# Altium schematic sheet Ampli_audio.SchDoc
size A4
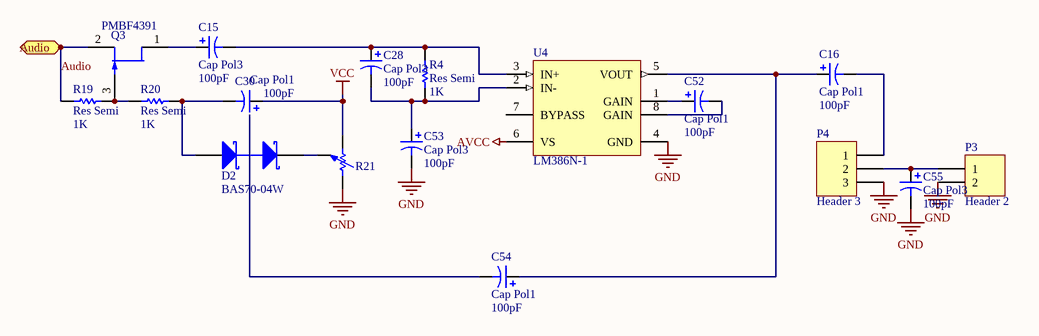
[diagram p0: Ampli_audio.SchDoc]

## Parts
C15  Cap Pol3  value 100pF  [C0805]
C16  Cap Pol1  value 100pF  [B]
C28  Cap Pol3  value 100pF  [C0805]
C30  Cap Pol1  value 100pF  [B]
C52  Cap Pol1  value 100pF  [B]
C53  Cap Pol3  value 100pF  [C0805]
C54  Cap Pol1  value 100pF  [B]
C55  Cap Pol3  value 100pF  [C0805]
D2  BAS70-04W  [SOT323_N]
P3  Header 2  [HDR1X2]
P4  Header 3  [HDR1X3]
Q3  PMBF4391  [SOT23_N]
R4  Res Semi  value 1K  [2012[0805]]
R19  Res Semi  value 1K  [2012[0805]]
R20  Res Semi  value 1K  [2012[0805]]
R21  Pot  [Potenciometro]  (value not drawn)
U4  LM386N-1  [N08E]

## Ports
Audio (in)

## Nets
AVCC: U4.6(VS)
GND: C53.2 C55.2 P3.2 P4.3 R21.1 U4.4(GND)
VCC: C30.1 R21.2
Audio: Q3.2(S) R19.1 ; port Audio
NetC15_1: C15.1 Q3.1(D)
NetC15_2: C15.2 C28.1 R4.2 U4.3(IN+)
NetC16_1: C16.1 C54.1 U4.5(VOUT)
NetC16_2: C16.2 P4.1
NetC28_2: C28.2 C53.1 R4.1 U4.2(IN-)
NetC30_2: C30.2 D2.1(A) R20.2
NetC52_1: C52.1 U4.1(GAIN)
NetC52_2: C52.2 U4.8(GAIN)
NetC54_2: C54.2 D2.3(C)
NetC55_1: C55.1 P3.1 P4.2
NetD2_2: D2.2(K) R21.3
NetQ3_3: Q3.3(G) R19.2 R20.1

Not connected (* = marked no-connect by the designer): U4 7(BYPASS)

## Library data of the parts
C15 C28 C53 C55 = Cap Pol3: Polarized Capacitor (Surface Mount); Published: 8-Jun-2000; LatestRevisionDate: 17-Jul-2002; LatestRevisionNote: Re-released for DXP Platform.; PackageReference: C0805; Publisher: Altium Limited
C16 C30 C52 C54 = Cap Pol1: Polarized Capacitor (Radial); Published: 8-Jun-2000; LatestRevisionDate: 17-Jul-2002; LatestRevisionNote: Re-released for DXP Platform.; PackageReference: RB7.6-15; Publisher: Altium Limited
D2 = BAS70-04W: Schottky Barrier Double Diode; Published: 17-Sep-2003; LatestRevisionDate: 12-Dec-2006; LatestRevisionNote: IPC-7351 Footprint Added.; DatasheetVersion: 26-Mar-1999; PackageVersion: Apr-1999; PackageReference: SOT323; Publisher: Altium Limited; PackageDescription: 3-Pin SOT-323 Package 0.65 mm Pitch, 2.1 mm Lead Span; ComponentLink1Description: Manufacturer Link; ComponentLink1URL: http://www.semiconductors.philips.com/; ComponentLink2Description: Datasheet; ComponentLink2URL: http://www.semiconductors.philips.com/acrobat/datasheets/BAS70W_3.pdf
P3 = Header 2: Header, 2-Pin; LatestRevisionDate: 17-Jul-2002; LatestRevisionNote: Re-released for DXP Platform.; Publisher: Altium Limited
P4 = Header 3: Header, 3-Pin; LatestRevisionDate: 17-Jul-2002; LatestRevisionNote: Re-released for DXP Platform.; Publisher: Altium Limited
Q3 = PMBF4391: N-channel Silicon Junction Field-effect Transistor; Published: 17-Sep-2003; LatestRevisionDate: 12-Dec-2006; LatestRevisionNote: IPC-7351 Footprint Added.; DatasheetVersion: Apr-1995; PackageVersion: May-1999; PackageReference: SOT23; Publisher: Altium Limited; PackageDescription: 3-Pin SOT-23 Package 0.95 mm Pitch, 2.3 mm Lead Span; ComponentLink1Description: Manufacturer Link; ComponentLink1URL: http://www.semiconductors.philips.com/; ComponentLink2Description: Datasheet; ComponentLink2URL: http://www.semiconductors.philips.com/acrobat/datasheets/PMBF4391_4392_4393_CNV_2.pdf
R4 R19 R20 = Res Semi: Semiconductor Resistor; Published: 8-Jun-2000; LatestRevisionDate: 17-Jul-2002; LatestRevisionNote: Re-released for DXP Platform.; PackageReference: AXIAL-0.5; Publisher: Altium Limited
U4 = LM386N-1: Low Voltage Audio Power Amplifier; Manufacturer: National Semiconductor; CompType: Audio IC; PackageTopMarking: NSUZXYTT*LM*386N-1; Published: 27-Nov-2008; DatasheetVersion: Aug-2000; PackageVersion: revG, May-2006; PackageReference: N08E; PackageDescription: MDIP, .365 x .250 x .130in, 8 Lead, .100in Pitch; PartNumber: LM386N-1; RoHS: O; PinCount: 8; DigiKeyPartNumber: LM386N-1-ND; Code_JEDEC: MS-001-BA; ComponentLink1Description: LM386 Datasheet; ComponentLink1URL: http://www.national.com/ds/LM/LM386.pdf; ComponentLink2Description: LM386 Web Page; ComponentLink2URL: http://www.national.com/pf/LM/LM386.html; ComponentLink3Description: N08E Package Page; ComponentLink3URL: http://www.national.com/packaging/folders/n08e.html